# EAGLE schematic md2_redraw (EAGLE 8.5.1)
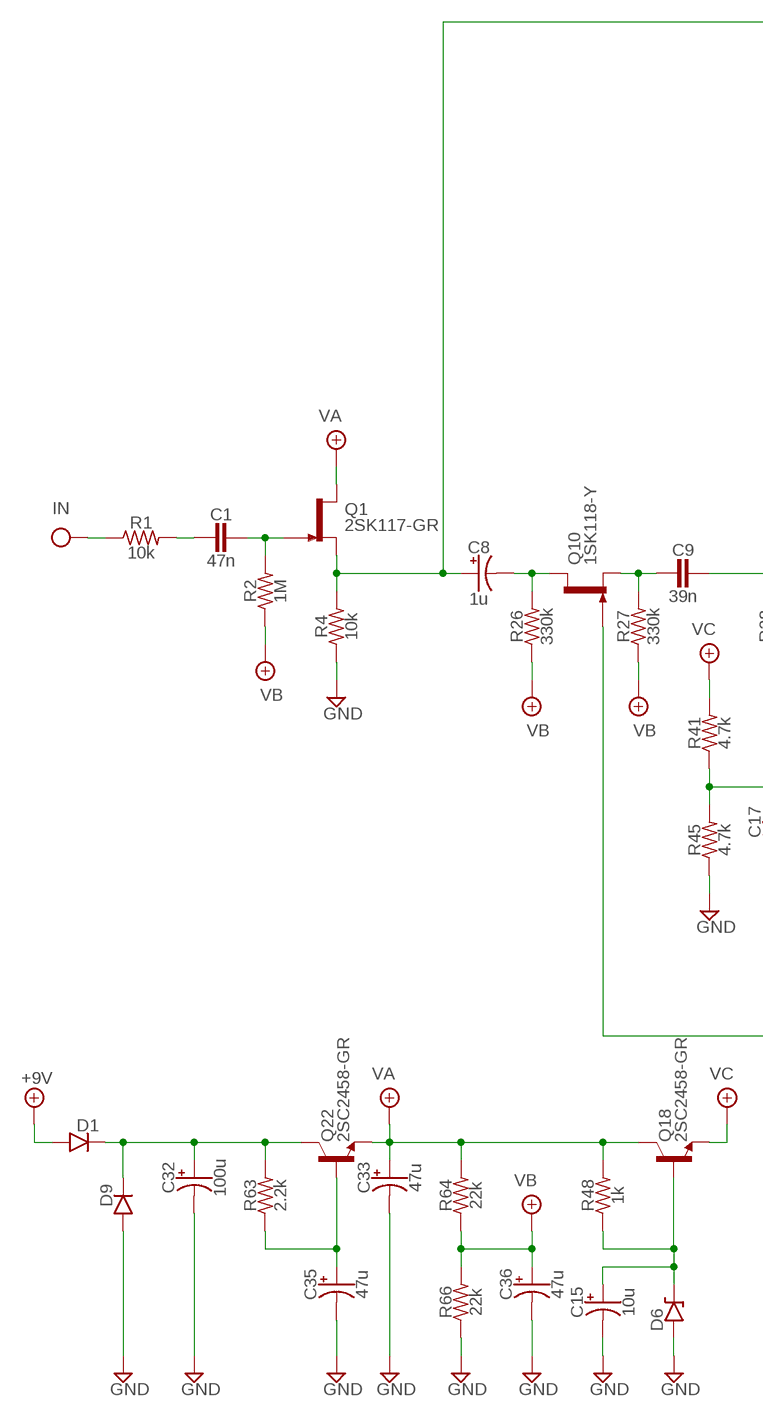
[diagram p0: schematic, sheet 1, part 1 of 2]
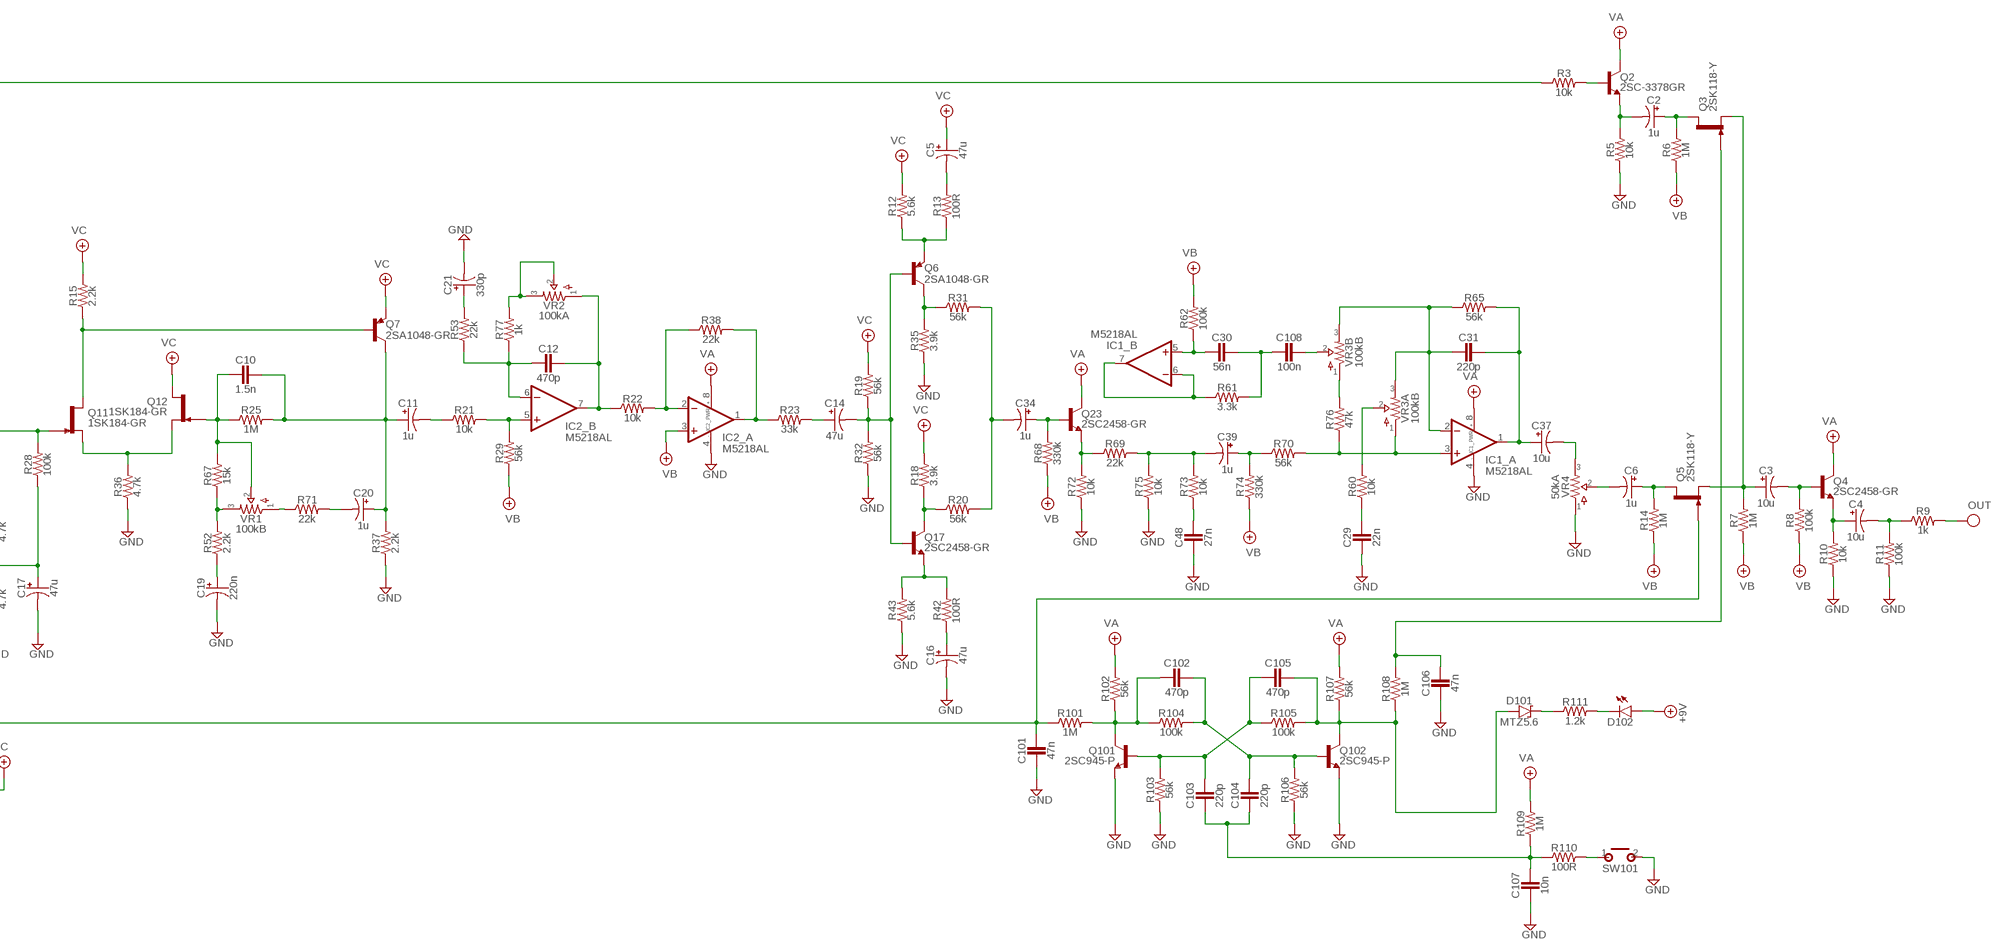
[diagram p1: schematic, sheet 1, part 2 of 2]

## Parts
C1  47n  CER/FILMBOX.1  [BOX_SMALL]
C2  1u  0400  [040_020]
C3  10u  0400  [040_020]
C4  10u  0400  [040_020]
C5  47u  0400  [040_020]
C6  1u  0400  [040_020]
C8  1u  0400  [040_020]
C9  39n  CER/FILMBOX.1  [BOX_SMALL]
C10  1.5n  CER/FILMBOX.1  [BOX_SMALL]
C11  1u  0400  [040_020]
C12  470p  CER/FILMBOX.1  [BOX_SMALL]
C14  47u  0400  [040_020]
C15  10u  0400  [040_020]
C16  47u  0400  [040_020]
C17  47u  0400  [040_020]
C19  220n  0400  [040_020]
C20  1u  0400  [040_020]
C21  330p  0400  [040_020]
C29  22n  CER/FILMBOX.1  [BOX_SMALL]
C30  56n  CER/FILMBOX.1  [BOX_SMALL]
C31  220p  CER/FILMBOX.1  [BOX_SMALL]
C32  100u  0400  [040_020]
C33  47u  0400  [040_020]
C34  1u  0400  [040_020]
C35  47u  0400  [040_020]
C36  47u  0400  [040_020]
C37  10u  0400  [040_020]
C39  1u  0400  [040_020]
C48  27n  CER/FILMBOX.1  [BOX_SMALL]
C101  47n  CER/FILMBOX.1  [BOX_SMALL]
C102  470p  CER/FILMBOX.1  [BOX_SMALL]
C103  220p  CER/FILMBOX.1  [BOX_SMALL]
C104  220p  CER/FILMBOX.1  [BOX_SMALL]
C105  470p  CER/FILMBOX.1  [BOX_SMALL]
C106  47n  CER/FILMBOX.1  [BOX_SMALL]
C107  10n  CER/FILMBOX.1  [BOX_SMALL]
C108  100n  CER/FILMBOX.1  [BOX_SMALL]
D1  DO35.2  [DO35-2]
D6  ZENER.2  [DO41-2]
D9  DO35.2  [DO35-2]
D101  MTZ5.6  ZENER.2  [DO41-2]
D102  LED  [3MM_D]
IC1  M5218AL  DUALTH  [DIL0]
IC2  M5218AL  DUALTH  [DIL0]
Q1  2SK117-GR  2N3819TO-92S  [TO92-]
Q2  2SC-3378GR  2SC828A  [TO92-]
Q3  2SK118-Y  2N3819TO-92S  [TO92-]
Q4  2SC2458-GR  2SC828A  [TO92-]
Q5  2SK118-Y  2N3819TO-92S  [TO92-]
Q6  2SA1048-GR  2N3906  [TO92]
Q7  2SA1048-GR  2N3906  [TO92]
Q10  1SK118-Y  2N3819TO-92S  [TO92-]
Q11  1SK184-GR  2N3819TO-92S  [TO92-]
Q12  1SK184-GR  2N3819TO-92S  [TO92-]
Q17  2SC2458-GR  2N3904  [TO92-]
Q18  2SC2458-GR  2SC828A  [TO92-]
Q22  2SC2458-GR  2SC828A  [TO92-]
Q23  2SC2458-GR  2N3904  [TO92-]
Q101  2SC945-P  2SC828A  [TO92-]
Q102  2SC945-P  2SC828A  [TO92-]
R1  10k  R_.3B  [R0207/3]
R2  1M  R_.3B  [R0207/3]
R3  10k  R_.3B  [R0207/3]
R4  10k  R_.3B  [R0207/3]
R5  10k  R_.3B  [R0207/3]
R6  1M  R_.3B  [R0207/3]
R7  1M  R_.3B  [R0207/3]
R8  100k  R_.3B  [R0207/3]
R9  1k  R_.3B  [R0207/3]
R10  10k  R_.3B  [R0207/3]
R11  100k  R_.3B  [R0207/3]
R12  5.6k  R_.3B  [R0207/3]
R13  100R  R_.3B  [R0207/3]
R14  1M  R_.3B  [R0207/3]
R15  2.2k  R_.3B  [R0207/3]
R18  3.9k  R_.3B  [R0207/3]
R19  56k  R_.3B  [R0207/3]
R20  56k  R_.3B  [R0207/3]
R21  10k  R_.3B  [R0207/3]
R22  10k  R_.3B  [R0207/3]
R23  33k  R_.3B  [R0207/3]
R25  1M  R_.3B  [R0207/3]
R26  330k  R_.3B  [R0207/3]
R27  330k  R_.3B  [R0207/3]
R28  100k  R_.3B  [R0207/3]
R29  56k  R_.3B  [R0207/3]
R31  56k  R_.3B  [R0207/3]
R32  56k  R_.3B  [R0207/3]
R35  3.9k  R_.3B  [R0207/3]
R36  4.7k  R_.3B  [R0207/3]
R37  2.2k  R_.3B  [R0207/3]
R38  22k  R_.3B  [R0207/3]
R41  4.7k  R_.3B  [R0207/3]
R42  100R  R_.3B  [R0207/3]
R43  5.6k  R_.3B  [R0207/3]
R45  4.7k  R_.3B  [R0207/3]
R48  1k  R_.3B  [R0207/3]
R52  2.2k  R_.3B  [R0207/3]
R53  22k  R_.3B  [R0207/3]
R60  10k  R_.3B  [R0207/3]
R61  3.3k  R_.3B  [R0207/3]
R62  100k  R_.3B  [R0207/3]
R63  2.2k  R_.3B  [R0207/3]
R64  22k  R_.3B  [R0207/3]
R65  56k  R_.3B  [R0207/3]
R66  22k  R_.3B  [R0207/3]
R67  15k  R_.3B  [R0207/3]
R68  330k  R_.3B  [R0207/3]
R69  22k  R_.3B  [R0207/3]
R70  56k  R_.3B  [R0207/3]
R71  22k  R_.3B  [R0207/3]
R72  10k  R_.3B  [R0207/3]
R73  10k  R_.3B  [R0207/3]
R74  330k  R_.3B  [R0207/3]
R75  10k  R_.3B  [R0207/3]
R76  47k  R_.3B  [R0207/3]
R77  1k  R_.3B  [R0207/3]
R101  1M  R_.3B  [R0207/3]
R102  56k  R_.3B  [R0207/3]
R103  56k  R_.3B  [R0207/3]
R104  100k  R_.3B  [R0207/3]
R105  100k  R_.3B  [R0207/3]
R106  56k  R_.3B  [R0207/3]
R107  56k  R_.3B  [R0207/3]
R108  1M  R_.3B  [R0207/3]
R109  1M  R_.3B  [R0207/3]
R110  100R  R_.3B  [R0207/3]
R111  1.2k  R_.3B  [R0207/3]
SW101  MOMENTARY  [SPST]
VR1  100kB  POTS16MM  [16MM]
VR2  100kA  POTS16MM  [16MM]
VR3A  100kB  POTS16MM  [16MM]
VR3B  100kB  POTS16MM  [16MM]
VR4  50kA  POTS16MM  [16MM]

## Nets
+9V: D1.A D102.ANODE(A)
GND: C15.- C16.- C17.- C19.- C21.- C29.2 C32.- C33.- C35.- C36.- C48.2 C101.2 C106.2 C107.2 D6.A D9.A IC1.4(_PWR:V-) IC2.4(_PWR:V-) Q101.3(E) Q102.3(E) R4.1 R5.1 R10.1 R11.1 R32.1 R35.1 R36.1 R37.1 R43.1 R45.1 R66.1 R72.1 R75.1 R103.1 R106.1 SW101.2(S) VR4.1
IN: R1.1
N$1: C32.+ D1.C D9.C Q22.2(C) R63.2
N$2: Q7.2(B) Q11.3(D) R15.1
N$3: C8.- Q10.3(D) R26.2
N$4: C35.+ Q22.1(B) R63.1
N$5: C9.2 Q10.1(S) R27.2
N$6: C15.+ D6.C Q18.1(B) R48.1
N$7: C1.2 R1.2
N$8: C1.1 Q1.2(G) R2.2
N$9: C9.1 Q11.2(G) R28.2
N$10: Q11.1(S) Q12.1(S) R36.2
N$11: C17.+ R28.1 R41.1 R45.2
N$12: C10.2 Q12.2(G) R25.1 R67.2 VR1.2
N$13: C11.- R21.1
N$14: R52.2 R67.1 VR1.3
N$15: C19.+ R52.1
N$16: C10.1 C11.+ C20.+ Q7.1(C) R25.2 R37.2
N$17: C20.- R71.2
N$18: R71.1 VR1.1
N$19: IC2.5(_B:+IN) R21.2 R29.2
N$20: C12.2 IC2.6(_B:-IN) R53.1 R77.1
N$21: C12.1 IC2.7(_B:OUT) R22.1 VR2.1
N$22: R77.2 VR2.2 VR2.3
N$23: IC2.2(_A:-IN) R22.2 R38.1
N$24: C21.+ R53.2
N$25: IC2.1(_A:OUT) R23.1 R38.2
N$26: C14.+ R23.2
N$27: C14.- Q6.2(B) Q17.2(B) R19.1 R32.2
N$28: Q6.1(C) R31.1 R35.2
N$29: C102.2 Q101.2(C) R101.2 R102.1 R104.1
N$30: C34.- R20.2 R31.2
N$31: C105.1 D101.A Q102.2(C) R105.2 R107.1 R108.1
N$32: C103.1 C105.2 Q101.1(B) R103.2 R105.1
N$33: Q17.1(C) R18.1 R20.1
N$34: C102.1 C104.1 Q102.1(B) R104.2 R106.2
N$35: C103.2 C104.2 C107.1 R109.1 R110.1
N$36: Q17.3(E) R42.2 R43.2
N$37: C16.+ R42.1
N$38: Q6.3(E) R12.1 R13.1
N$39: C5.- R13.2
N$40: C34.+ Q23.2(B) R68.2
N$41: Q23.3(E) R69.1 R72.2
N$42: C39.- R69.2 R73.2 R75.2
N$43: C48.1 R73.1
N$44: C39.+ R70.1 R74.2
N$45: IC1.6(_B:-IN) IC1.7(_B:OUT) R61.1
N$46: R60.2 VR3A.2
N$47: C30.2 IC1.5(_B:+IN) R62.1
N$48: C30.1 C108.2 R61.2
N$49: C108.1 VR3B.2
N$50: R76.2 VR3B.1
N$51: IC1.3(_A:+IN) R70.2 R76.1 VR3A.1
N$52: C29.1 R60.1
N$53: C31.2 IC1.2(_A:-IN) R65.1 VR3A.3 VR3B.3
N$54: Q2.1(B) R3.2
N$55: C31.1 C37.+ IC1.1(_A:OUT) R65.2
N$56: C37.- VR4.3
N$57: C101.1 Q5.2(G) Q10.2(G) R101.1
N$58: C6.+ Q5.3(D) R14.2
N$59: C106.1 Q3.2(G) R108.2
N$60: C3.+ Q3.1(S) Q5.1(S) R7.2
N$61: C6.- VR4.2
N$63: C2.- Q2.3(E) R5.2
N$64: C2.+ Q3.3(D) R6.2
N$66: R110.2 SW101.1(P)
N$73: D101.C R111.1
N$74: D102.P$1(C) R111.2
N$77: C3.- Q4.1(B) R8.2
N$78: C4.+ Q4.3(E) R10.2
N$80: C4.- R9.1 R11.2
N$107: C8.+ Q1.1(S) R3.1 R4.2
OUT: R9.2
VA: C33.+ IC1.8(_PWR:V+) IC2.8(_PWR:V+) Q1.3(D) Q2.2(C) Q4.2(C) Q18.2(C) Q22.3(E) Q23.1(C) R48.2 R64.2 R102.2 R107.2 R109.2
VB: C36.+ IC2.3(_A:+IN) R2.1 R6.1 R7.1 R8.1 R14.1 R26.1 R27.1 R29.1 R62.2 R64.1 R66.2 R68.1 R74.1
VC: C5.+ Q7.3(E) Q12.3(D) Q18.3(E) R12.2 R15.2 R18.2 R19.2 R41.2

## Library data of the parts
C1 C9 C10 C12 C29-C31 C48 C101-C108 = pedals-capacitors-film:CER/FILM: 47 - 120pF Xicon Ceramic Disc 2.5mm lead spacing
C2-C6 C8 C11 C14-C17 C19-C21 C32-C37 C39 = pedals-capacitors-elec:040
D1 D9 = pedals-diodes:DO35: DO-35 Package Diodes: 1N914
D6 D101 = pedals-diodes:ZENER
D102 = pedals-diodes:LED
IC1 IC2 = pedals-integrated circuits:DUAL: OP AMP
Q1 Q3 Q5 Q10-Q12 = pedals-transistors:2N3819: N-CHANNEL FET
Q2 Q4 Q18 Q22 Q101 Q102 = pedals-transistors:2SC828A
Q6 Q7 = pedals-transistors:2N3906: PNP Transistor
Q17 Q23 = pedals-transistors:2N3904: NPN Transistor
R1-R15 R18-R23 R25-R29 R31 R32 R35-R38 R41-R43 R45 R48 R52 R53 R60-R77 R101-R111 = pedals-resistors:R_
SW101 = pedals-switches:MOMENTARY
VR1 VR2 VR3A VR3B VR4 = pedals-potentiometers:POTS